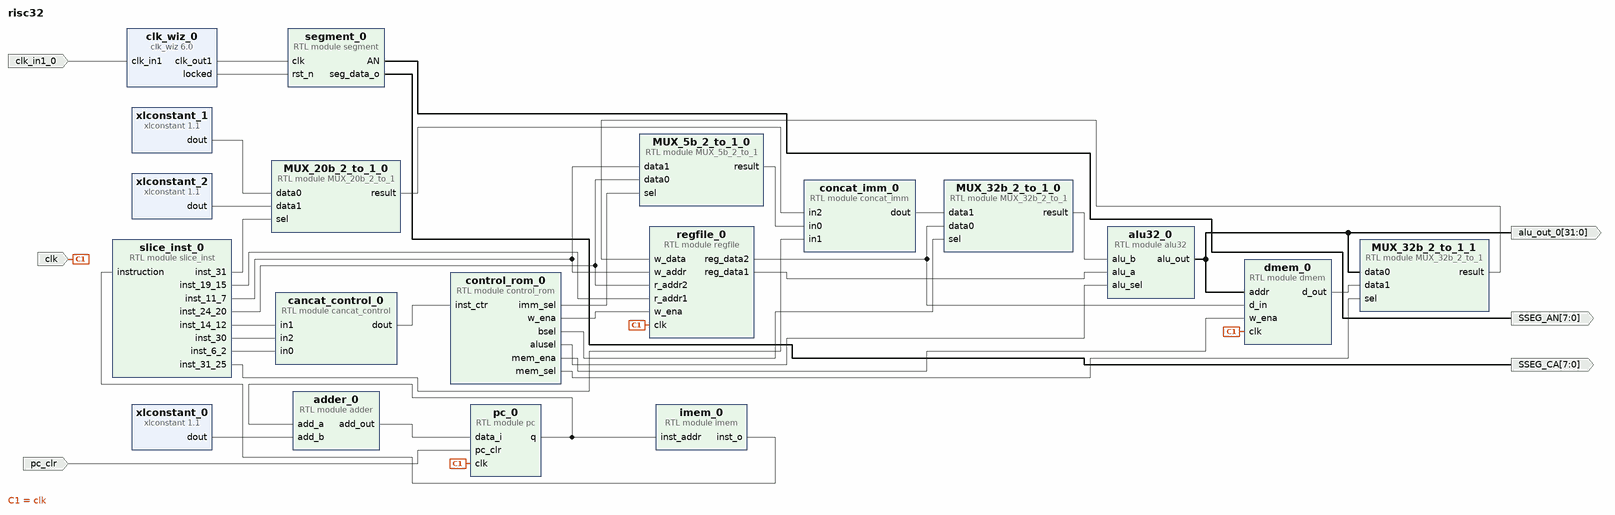
[diagram p0: block diagram of the top level]
# Vivado block design risc32, xc7a100tcsg324-1, Vivado 2022.2
create_bd_design risc32

create_bd_port -dir I -type clk clk
create_bd_port -dir I pc_clr
create_bd_port -dir I -type clk clk_in1_0
create_bd_port -dir O -from 7 -to 0 SSEG_AN
create_bd_port -dir O -from 7 -to 0 SSEG_CA
create_bd_port -dir O -from 31 -to 0 alu_out_0

create_bd_cell -type module -reference adder adder_0
create_bd_cell -type ip -vlnv xilinx.com:ip:xlconstant:1.1 xlconstant_0
set_property -dict {CONFIG.CONST_VAL 4 CONFIG.CONST_WIDTH 32} [get_bd_cells xlconstant_0]
create_bd_cell -type module -reference slice_inst slice_inst_0
create_bd_cell -type module -reference cancat_control cancat_control_0
create_bd_cell -type module -reference control_rom control_rom_0
create_bd_cell -type module -reference segment segment_0
create_bd_cell -type ip -vlnv xilinx.com:ip:clk_wiz:6.0 clk_wiz_0
set_property -dict [list \
  CONFIG.CLKOUT1_DRIVES BUFG \
  CONFIG.CLKOUT1_JITTER 203.457 \
  CONFIG.CLKOUT1_PHASE_ERROR 155.540 \
  CONFIG.CLKOUT1_REQUESTED_OUT_FREQ 50.000 \
  CONFIG.CLKOUT2_DRIVES BUFG \
  CONFIG.CLKOUT3_DRIVES BUFG \
  CONFIG.CLKOUT4_DRIVES BUFG \
  CONFIG.CLKOUT5_DRIVES BUFG \
  CONFIG.CLKOUT6_DRIVES BUFG \
  CONFIG.CLKOUT7_DRIVES BUFG \
  CONFIG.MMCM_BANDWIDTH OPTIMIZED \
  CONFIG.MMCM_CLKFBOUT_MULT_F 17 \
  CONFIG.MMCM_CLKOUT0_DIVIDE_F 17 \
  CONFIG.MMCM_COMPENSATION ZHOLD \
  CONFIG.MMCM_DIVCLK_DIVIDE 2 \
  CONFIG.PRIMITIVE PLL \
  CONFIG.PRIM_IN_FREQ 100.000 \
  CONFIG.USE_RESET false \
] [get_bd_cells clk_wiz_0]
create_bd_cell -type module -reference pc pc_0
create_bd_cell -type module -reference alu32 alu32_0
create_bd_cell -type module -reference regfile regfile_0
create_bd_cell -type module -reference concat_imm concat_imm_0
create_bd_cell -type module -reference MUX_20b_2_to_1 MUX_20b_2_to_1_0
create_bd_cell -type ip -vlnv xilinx.com:ip:xlconstant:1.1 xlconstant_1
set_property -dict {CONFIG.CONST_VAL 0 CONFIG.CONST_WIDTH 20} [get_bd_cells xlconstant_1]
create_bd_cell -type ip -vlnv xilinx.com:ip:xlconstant:1.1 xlconstant_2
set_property -dict {CONFIG.CONST_VAL 1048575 CONFIG.CONST_WIDTH 20} [get_bd_cells xlconstant_2]
create_bd_cell -type module -reference MUX_32b_2_to_1 MUX_32b_2_to_1_0
create_bd_cell -type module -reference dmem dmem_0
create_bd_cell -type module -reference MUX_32b_2_to_1 MUX_32b_2_to_1_1
create_bd_cell -type module -reference MUX_5b_2_to_1 MUX_5b_2_to_1_0
create_bd_cell -type module -reference imem imem_0

# ---- connections ----

connect_bd_net [get_bd_pins MUX_20b_2_to_1_0/result] [get_bd_pins concat_imm_0/in2]
connect_bd_net [get_bd_pins MUX_32b_2_to_1_0/result] [get_bd_pins alu32_0/alu_b]
connect_bd_net [get_bd_pins MUX_32b_2_to_1_1/result] [get_bd_pins regfile_0/w_data]
connect_bd_net [get_bd_pins MUX_5b_2_to_1_0/result] [get_bd_pins concat_imm_0/in0]
connect_bd_net [get_bd_pins adder_0/add_out] [get_bd_pins pc_0/data_i]
connect_bd_net [get_bd_pins alu32_0/alu_out] [get_bd_ports alu_out_0] [get_bd_pins dmem_0/addr] [get_bd_pins MUX_32b_2_to_1_1/data0]
connect_bd_net [get_bd_pins cancat_control_0/dout] [get_bd_pins control_rom_0/inst_ctr]
connect_bd_net -net clk_0_1 [get_bd_ports clk] [get_bd_pins pc_0/clk] [get_bd_pins regfile_0/clk] [get_bd_pins dmem_0/clk]
connect_bd_net -net clk_in1_0_1 [get_bd_ports clk_in1_0] [get_bd_pins clk_wiz_0/clk_in1]
connect_bd_net [get_bd_pins clk_wiz_0/clk_out1] [get_bd_pins segment_0/clk]
connect_bd_net [get_bd_pins clk_wiz_0/locked] [get_bd_pins segment_0/rst_n]
connect_bd_net [get_bd_pins concat_imm_0/dout] [get_bd_pins MUX_32b_2_to_1_0/data1]
connect_bd_net [get_bd_pins control_rom_0/alusel] [get_bd_pins alu32_0/alu_sel]
connect_bd_net [get_bd_pins control_rom_0/bsel] [get_bd_pins MUX_32b_2_to_1_0/sel]
connect_bd_net [get_bd_pins control_rom_0/imm_sel] [get_bd_pins MUX_5b_2_to_1_0/sel]
connect_bd_net [get_bd_pins control_rom_0/mem_ena] [get_bd_pins dmem_0/w_ena]
connect_bd_net [get_bd_pins control_rom_0/mem_sel] [get_bd_pins MUX_32b_2_to_1_1/sel]
connect_bd_net [get_bd_pins control_rom_0/w_ena] [get_bd_pins regfile_0/w_ena]
connect_bd_net [get_bd_pins dmem_0/d_out] [get_bd_pins MUX_32b_2_to_1_1/data1]
connect_bd_net -net imem_0_inst [get_bd_pins imem_0/inst_o] [get_bd_pins slice_inst_0/instruction]
connect_bd_net [get_bd_pins pc_0/q] [get_bd_pins adder_0/add_a] [get_bd_pins imem_0/inst_addr]
connect_bd_net -net pc_clr_0_1 [get_bd_ports pc_clr] [get_bd_pins pc_0/pc_clr]
connect_bd_net [get_bd_pins regfile_0/reg_data1] [get_bd_pins alu32_0/alu_a]
connect_bd_net [get_bd_pins regfile_0/reg_data2] [get_bd_pins MUX_32b_2_to_1_0/data0] [get_bd_pins dmem_0/d_in]
connect_bd_net [get_bd_pins segment_0/AN] [get_bd_ports SSEG_AN]
connect_bd_net [get_bd_pins segment_0/seg_data_o] [get_bd_ports SSEG_CA]
connect_bd_net [get_bd_pins slice_inst_0/inst_11_7] [get_bd_pins regfile_0/w_addr] [get_bd_pins MUX_5b_2_to_1_0/data1]
connect_bd_net [get_bd_pins slice_inst_0/inst_14_12] [get_bd_pins cancat_control_0/in1]
connect_bd_net [get_bd_pins slice_inst_0/inst_19_15] [get_bd_pins regfile_0/r_addr1]
connect_bd_net [get_bd_pins slice_inst_0/inst_24_20] [get_bd_pins regfile_0/r_addr2] [get_bd_pins MUX_5b_2_to_1_0/data0]
connect_bd_net [get_bd_pins slice_inst_0/inst_30] [get_bd_pins cancat_control_0/in2]
connect_bd_net [get_bd_pins slice_inst_0/inst_31] [get_bd_pins MUX_20b_2_to_1_0/sel]
connect_bd_net [get_bd_pins slice_inst_0/inst_31_25] [get_bd_pins concat_imm_0/in1]
connect_bd_net [get_bd_pins slice_inst_0/inst_6_2] [get_bd_pins cancat_control_0/in0]
connect_bd_net [get_bd_pins xlconstant_0/dout] [get_bd_pins adder_0/add_b]
connect_bd_net [get_bd_pins xlconstant_1/dout] [get_bd_pins MUX_20b_2_to_1_0/data0]
connect_bd_net [get_bd_pins xlconstant_2/dout] [get_bd_pins MUX_20b_2_to_1_0/data1]

validate_bd_design
save_bd_design
